# Altium schematic sheet Display.SchDoc
size 420 x 297 mm; SheetNumber: 4; SheetTotal: 4
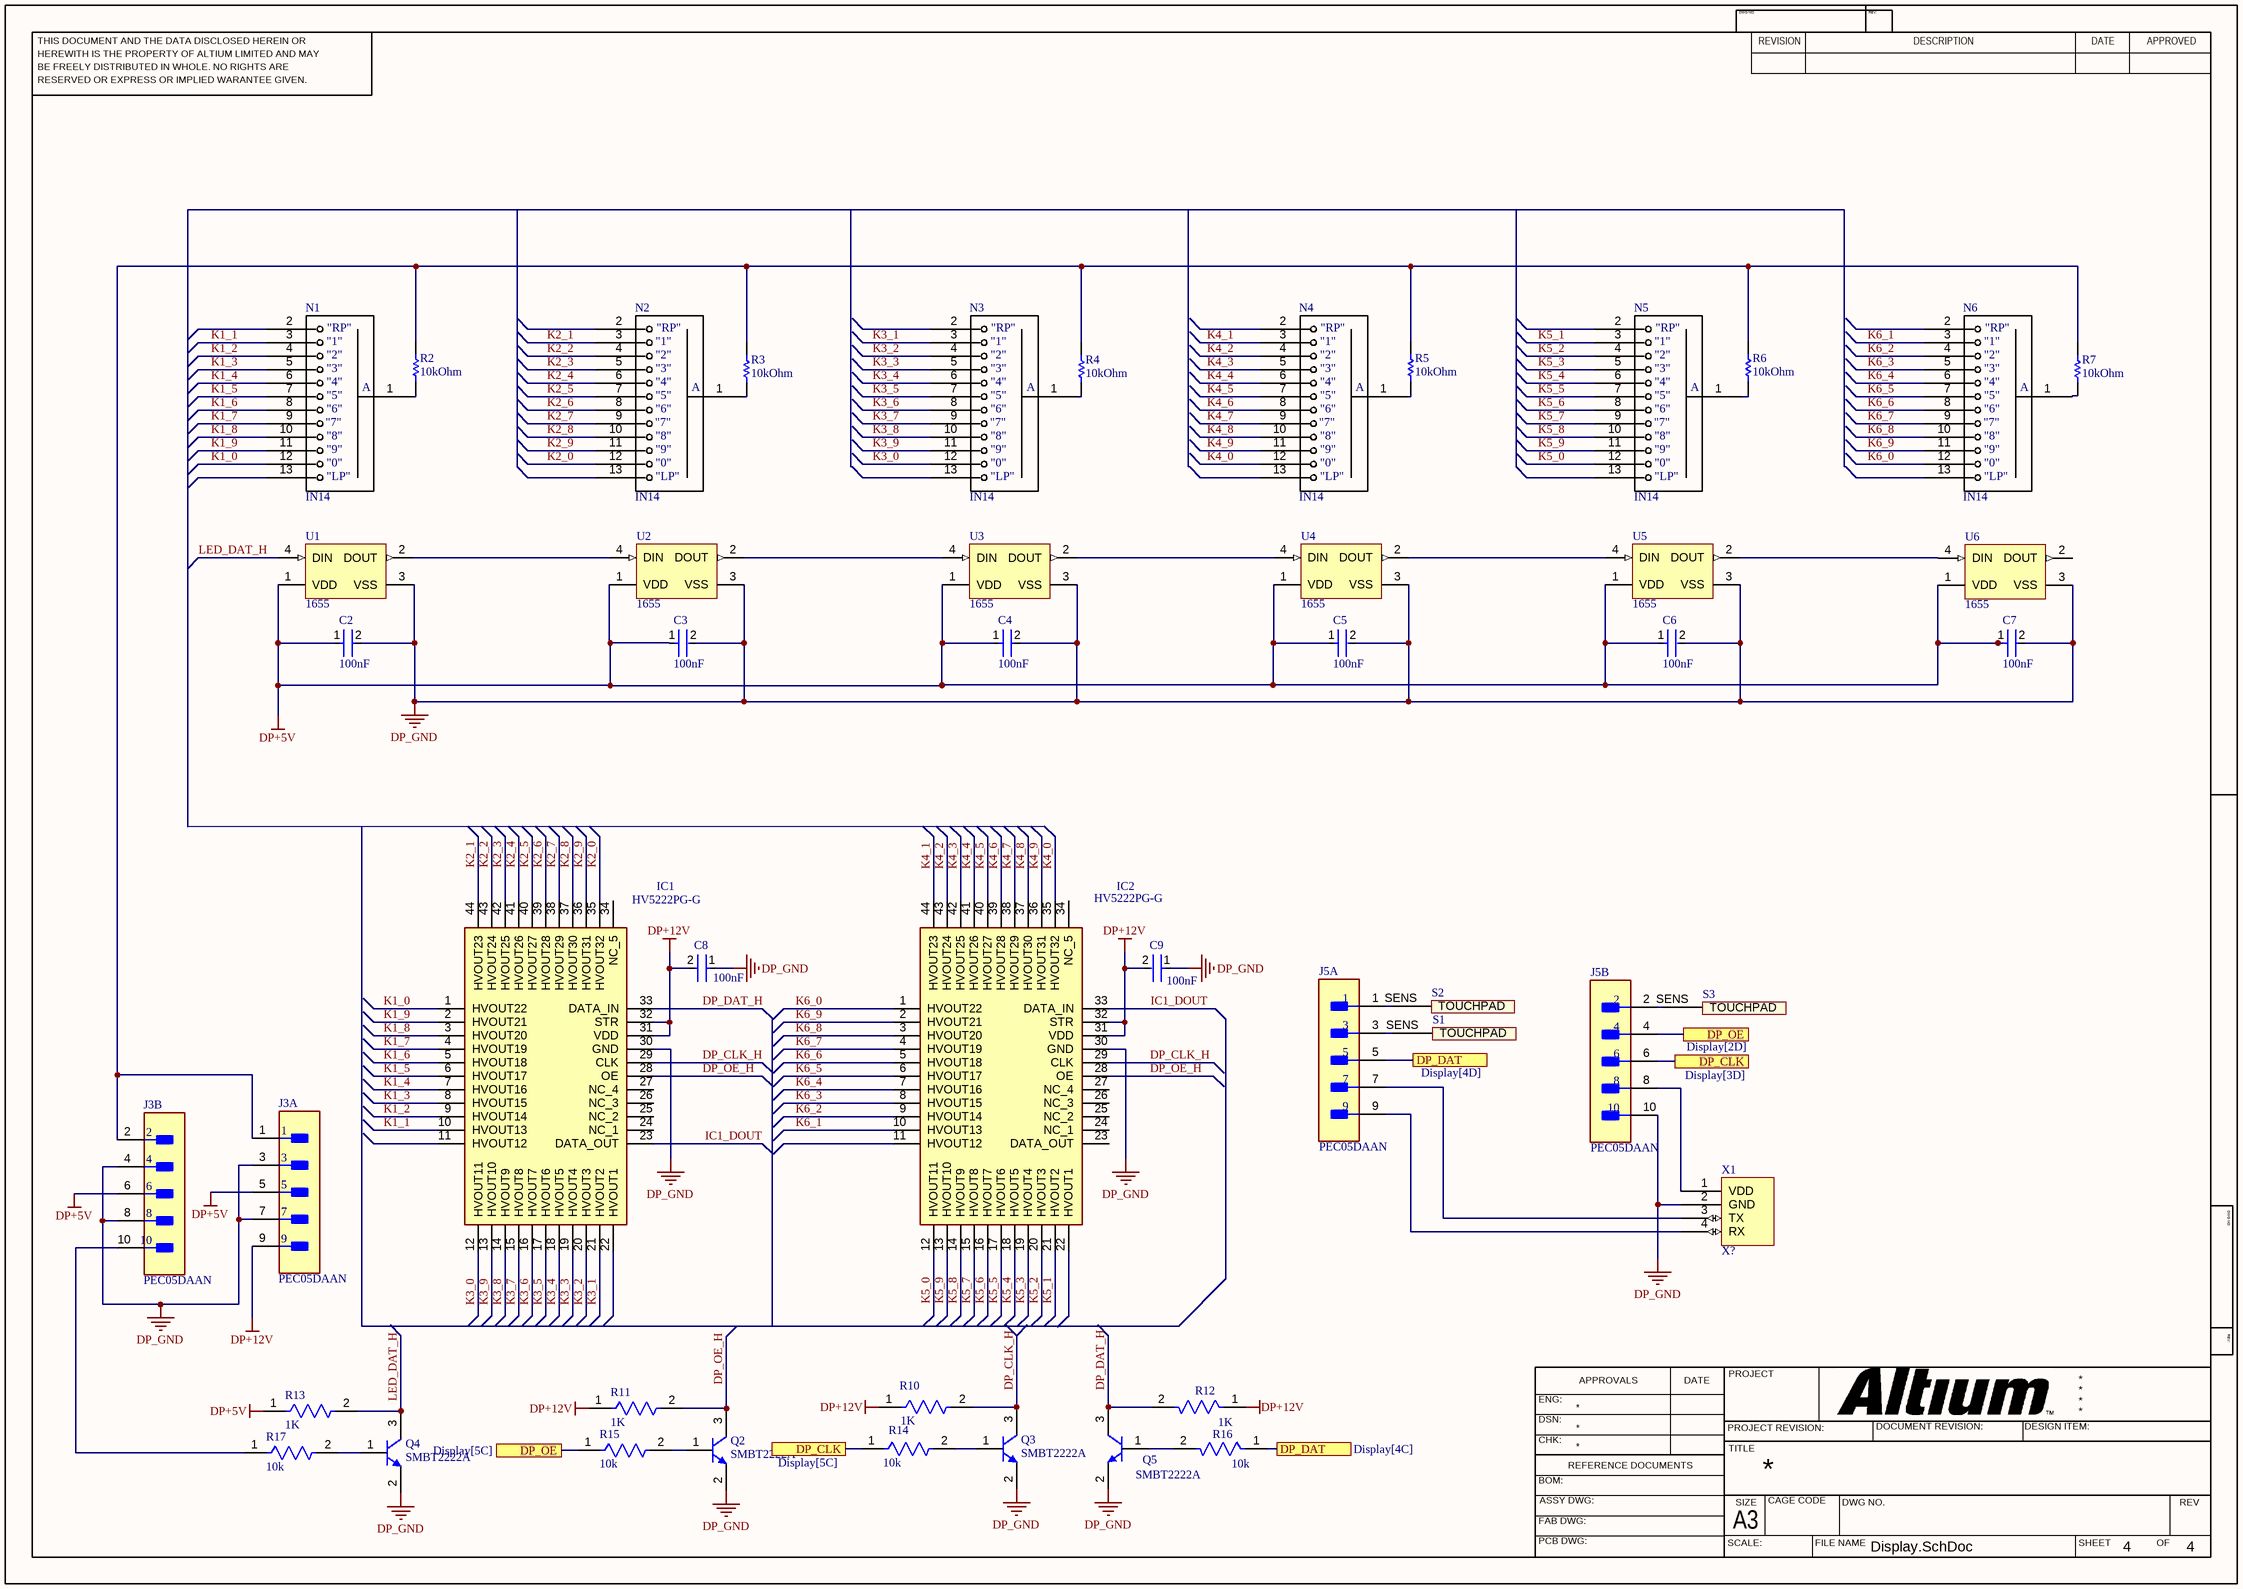
[diagram p0: Display.SchDoc]

## Parts
C2  100nF  [FP-CC0805-0_85-MFG]
C3  100nF  [FP-CC0805-0_85-MFG]
C4  100nF  [FP-CC0805-0_85-MFG]
C5  100nF  [FP-CC0805-0_85-MFG]
C6  100nF  [FP-CC0805-0_85-MFG]
C7  100nF  [FP-CC0805-0_85-MFG]
C8  100nF  [FP-CC0805-0_85-MFG]
C9  100nF  [FP-CC0805-0_85-MFG]
IC1  HV5222PG-G  [QFP80P1390X1390X235-44N]
IC2  HV5222PG-G  [QFP80P1390X1390X235-44N]
J3  PEC05DAAN  [FP-PEC05DAAN-MFG]  (parts A,B of 2)
J5  PEC05DAAN  [FP-PEC05DAAN-MFG]  (parts A,B of 2)
N1  IN14  [IN14]
N2  IN14  [IN14]
N3  IN14  [IN14]
N4  IN14  [IN14]
N5  IN14  [IN14]
N6  IN14  [IN14]
Q2  SMBT2222A  [INF-SOT23_L]
Q3  SMBT2222A  [INF-SOT23_L]
Q4  SMBT2222A  [INF-SOT23_L]
Q5  SMBT2222A  [INF-SOT23_L]
R2  10kOhm  [RESC3116X65X40ML10T20]
R3  10kOhm  [RESC3116X65X40ML10T20]
R4  10kOhm  [RESC3116X65X40ML10T20]
R5  10kOhm  [RESC3116X65X40ML10T20]
R6  10kOhm  [RESC3116X65X40ML10T20]
R7  10kOhm  [RESC3116X65X40ML10T20]
R10  1K  [FP-RC0805-0_6-IPC_C]
R11  1K  [FP-RC0805-0_6-IPC_C]
R12  1K  [FP-RC0805-0_6-IPC_C]
R13  1K  [FP-RC0805-0_6-IPC_C]
R14  10k  [FP-RC0805-0_6-IPC_C]
R15  10k  [FP-RC0805-0_6-IPC_C]
R16  10k  [FP-RC0805-0_6-IPC_C]
R17  10k  [FP-RC0805-0_6-IPC_C]
S1  (no value)  [SENS]
S2  TOUCHPAD  [SENS]  (value not drawn)
S3  TOUCHPAD  [SENS]  (value not drawn)
U1  1655  [ADA-RGB-1655_V]
U2  1655  [ADA-RGB-1655_V]
U3  1655  [ADA-RGB-1655_V]
U4  1655  [ADA-RGB-1655_V]
U5  1655  [ADA-RGB-1655_V]
U6  1655  [ADA-RGB-1655_V]
X1  X?  [4X1HEADER]

## Ports
DP_CLK (see Display[3D]), DP_CLK (see Display[5C]), DP_DAT (see Display[4C]), DP_DAT (see Display[4D]), DP_OE (see Display[2D]), DP_OE (see Display[5C])

## Nets
DP+5V: C2.1 C3.1 C4.1 C5.1 C6.1 C7.1 J3.5 J3.6 R13.1 U1.1(VDD) U2.1(VDD) U3.1(VDD) U4.1(VDD) U5.1(VDD) U6.1(VDD)
DP+12V: C8.2 C9.2 IC1.31(VDD) IC1.32(STR) IC2.31(VDD) IC2.32(STR) J3.9 R10.1 R11.1 R12.1
DP_GND: C2.2 C3.2 C4.2 C5.2 C6.2 C7.2 C8.1 C9.1 IC1.30(GND) IC2.30(GND) J3.3 J3.4 J3.7 J3.8 J5.10 Q2.2(E) Q3.2(E) Q4.2(E) Q5.2(E) U1.3(VSS) U2.3(VSS) U3.3(VSS) U4.3(VSS) U5.3(VSS) U6.3(VSS) X1.2(GND)
DP_CLK: J5.6 R14.1 ; port DP_CLK
DP_CLK_H: IC1.29(CLK) IC2.29(CLK) Q3.3(C) R10.2
DP_DAT: J5.5 R16.1 ; port DP_DAT
DP_DAT_H: IC1.33(DATA_IN) Q5.3(C) R12.2
DP_OE: J5.4 R15.1 ; port DP_OE
DP_OE_H: IC1.28(OE) IC2.28(OE) Q2.3(C) R11.2
IC1_DOUT: IC1.23(DATA_OUT) IC2.33(DATA_IN)
K1_0: IC1.1(HVOUT22) N1.12
K1_1: IC1.10(HVOUT13) N1.3
K1_2: IC1.9(HVOUT14) N1.4
K1_3: IC1.8(HVOUT15) N1.5
K1_4: IC1.7(HVOUT16) N1.6
K1_5: IC1.6(HVOUT17) N1.7
K1_6: IC1.5(HVOUT18) N1.8
K1_7: IC1.4(HVOUT19) N1.9
K1_8: IC1.3(HVOUT20) N1.10
K1_9: IC1.2(HVOUT21) N1.11
K2_0: IC1.35(HVOUT32) N2.12
K2_1: IC1.44(HVOUT23) N2.3
K2_2: IC1.43(HVOUT24) N2.4
K2_3: IC1.42(HVOUT25) N2.5
K2_4: IC1.41(HVOUT26) N2.6
K2_5: IC1.40(HVOUT27) N2.7
K2_6: IC1.39(HVOUT28) N2.8
K2_7: IC1.38(HVOUT29) N2.9
K2_8: IC1.37(HVOUT30) N2.10
K2_9: IC1.36(HVOUT31) N2.11
K3_0: IC1.12(HVOUT11) N3.12
K3_1: IC1.21(HVOUT2) N3.3
K3_2: IC1.20(HVOUT3) N3.4
K3_3: IC1.19(HVOUT4) N3.5
K3_4: IC1.18(HVOUT5) N3.6
K3_5: IC1.17(HVOUT6) N3.7
K3_6: IC1.16(HVOUT7) N3.8
K3_7: IC1.15(HVOUT8) N3.9
K3_8: IC1.14(HVOUT9) N3.10
K3_9: IC1.13(HVOUT10) N3.11
K4_0: IC2.35(HVOUT32) N4.12
K4_1: IC2.44(HVOUT23) N4.3
K4_2: IC2.43(HVOUT24) N4.4
K4_3: IC2.42(HVOUT25) N4.5
K4_4: IC2.41(HVOUT26) N4.6
K4_5: IC2.40(HVOUT27) N4.7
K4_6: IC2.39(HVOUT28) N4.8
K4_7: IC2.38(HVOUT29) N4.9
K4_8: IC2.37(HVOUT30) N4.10
K4_9: IC2.36(HVOUT31) N4.11
K5_0: IC2.12(HVOUT11) N5.12
K5_1: IC2.21(HVOUT2) N5.3
K5_2: IC2.20(HVOUT3) N5.4
K5_3: IC2.19(HVOUT4) N5.5
K5_4: IC2.18(HVOUT5) N5.6
K5_5: IC2.17(HVOUT6) N5.7
K5_6: IC2.16(HVOUT7) N5.8
K5_7: IC2.15(HVOUT8) N5.9
K5_8: IC2.14(HVOUT9) N5.10
K5_9: IC2.13(HVOUT10) N5.11
K6_0: IC2.1(HVOUT22) N6.12
K6_1: IC2.10(HVOUT13) N6.3
K6_2: IC2.9(HVOUT14) N6.4
K6_3: IC2.8(HVOUT15) N6.5
K6_4: IC2.7(HVOUT16) N6.6
K6_5: IC2.6(HVOUT17) N6.7
K6_6: IC2.5(HVOUT18) N6.8
K6_7: IC2.4(HVOUT19) N6.9
K6_8: IC2.3(HVOUT20) N6.10
K6_9: IC2.2(HVOUT21) N6.11
LED_DAT_H: Q4.3(C) R13.2 U1.4(DIN)
NetJ3_1: J3.1 J3.2 R2.2 R3.2 R4.2 R5.2 R6.2 R7.2
NetJ3_10: J3.10 R17.1
NetJ5_1: J5.1 S2.SENS(TOUCHPAD)
NetJ5_2: J5.2 S3.SENS(TOUCHPAD)
NetJ5_3: J5.3 S1.SENS(TOUCHPAD)
NetJ5_7: J5.7 X1.3(TX)
NetJ5_8: J5.8 X1.1(VDD)
NetJ5_9: J5.9 X1.4(RX)
NetN1_1: N1.1 R2.1
NetN2_1: N2.1 R3.1
NetN3_1: N3.1 R4.1
NetN4_1: N4.1 R5.1
NetN5_1: N5.1 R6.1
NetN6_1: N6.1 R7.1
NetQ2_1: Q2.1(B) R15.2
NetQ3_1: Q3.1(B) R14.2
NetQ4_1: Q4.1(B) R17.2
NetQ5_1: Q5.1(B) R16.2
NetU1_2: U1.2(DOUT) U2.4(DIN)
NetU2_2: U2.2(DOUT) U3.4(DIN)
NetU3_2: U3.2(DOUT) U4.4(DIN)
NetU4_2: U4.2(DOUT) U5.4(DIN)
NetU5_2: U5.2(DOUT) U6.4(DIN)

Not connected (* = marked no-connect by the designer): IC1 11(HVOUT12) 22(HVOUT1) 24(NC_1) 25(NC_2) 26(NC_3) 27(NC_4) 34(NC_5); IC2 11(HVOUT12) 22(HVOUT1) 23(DATA_OUT) 24(NC_1) 25(NC_2) 26(NC_3) 27(NC_4) 34(NC_5); N1 2 13; N2 2 13; N3 2 13; N4 2 13; N5 2 13; N6 2 13; U6 2(DOUT)

## Notes on the sheet
- THIS DOCUMENT AND THE DATA DISCLOSED HEREIN OR
- HEREWITH IS THE PROPERTY OF ALTIUM LIMITED AND MAY
- DWG NO:
- REVISION
- REV:
- DESCRIPTION
- DATE
- APPROVED
- BE FREELY DISTRIBUTED IN WHOLE. NO RIGHTS ARE
- RESERVED OR EXPRESS OR IMPLIED WARANTEE GIVEN.
- ENG:
- APPROVALS
- PROJECT
- DSN:
- CHK:
- REFERENCE DOCUMENTS
- PROJECT REVISION:
- TITLE
- DOCUMENT REVISION:
- DESIGN ITEM:
- BOM:
- FAB DWG:
- PCB DWG:
- ASSY DWG:
- SCALE:
- A3
- SIZE
- CAGE CODE
- FILE NAME
- DWG NO.
- SHEET
- OF
- REV
- (in symbol IN14) "RP"; "1"; "2"; "3"; "4"; A; "5"; "6"; "7"; "8"; "9"; "0"; "LP"

## Library data of the parts
C2-C9 = CMP-2100-03606-3: CAP CER 0.1UF 50V X7R 0805; Manufacturer Part Number: CC0805KRX7R9BB104; Manufacturer: Yageo; Tolerance: 0.1; Material: Ceramic; Device Class L1: Passive Components; ComponentLink2Description: Datasheet; Package: CC0805-0.85; Digikey Description: CAP CER 0.1UF 50V X7R 0805; Capacitance: 100 nF; Device Class L3: Ceramic Capacitors; Value: 100 nF; Temperature: -30°C to +85°C; Temperature Characteristic: X7R; Voltage Rating: 50 V; Height: 0.95mm; RoHS: TRUE; Ipc Land Pattern Name: CAPC200125X85; Device Class L2: Capacitors; Category: Cap; Temperature Range Low: -30°C; Temperature Range High: +85°C; Mouser Description: Multilayer Ceramic Capacitors MLCC - SMD/SMT 100nF 50V X7R 10%; Footprint Url: http://www.yageo.com/exep/pages/download/literatures/UPY-C_GEN_24.pdf; Automotive: No; Octopart: https://octopart.com/cc0805krx7r9bb104-yageo-192993; Lead Free: Yes; ComponentLink2URL: http://www.yageo.com/documents/recent/UPY-GPHC_Y5V_6.3V-to-50V_8.pdf
IC1 IC2 = HV5222PG-G: Integrated Circuit; Manufacturer_Name: Microchip; Datasheet Link: http://www.microchip.com/mymicrochip/filehandler.aspx?ddocname=en570722; Height: 2.35mm; Manufacturer_Part_Number: HV5222PG-G; Mouser Part Number: 689-HV5222PG-G; Mouser Price/Stock: https://www.mouser.co.uk/ProductDetail/Microchip-Technology/HV5222PG-G?qs=jjdktuRV%2Fgh6FkXzyQ9ehg%3D%3D; Arrow Part Number: HV5222PG-G; Arrow Price/Stock: https://www.arrow.com/en/products/hv5222pg-g/microchip-technology
J3 J5 = CMP-25680-000034-1: CONN HEADER VERT 10POS 2.54MM; Pitch: 0.1inch; Number of Positions: 10; Gender: Male; Connector Type: Male Pin; Contact Type: Male Pin; Height: 2.54mm; Termination: Solder; Packaging: Bulk; Housing Material: Plastic; Contact Mating Length: 0.23inch; Width: 5.08mm; Row Spacing: 0.1inch; Housing Color: Black; Mount: Through Hole; Contact Plating: Tin; Contact Material: Bronze; Color: Black; Package Quantity: 1; Length: 12.7mm; Lead Free: Lead Free; Number of Rows: 2; Number of Contacts: 10
Q2-Q5 = CMP-1178-00004-1: NPN Silicon Switching Transistor, 40 V VCEO, 600 mA IC, SOT23, Reel, Green; Manufacturer: Infineon; IC (max): 600 mA; IC: 150 mA; VCE: 10 V; VCEO (max): 40 V; VCBO (max): 75 V; VEBO (max): 6 V; ICBO (max): 10 nA; Green: TRUE; Mounting Technology: Surface Mount; PackageDescription: 3-Pin Small Outline Transistor Package, 1.3 x 2.9 mm Body, 0.95 mm Pitch; ComponentLink1Description: Manufacturer URL; ComponentLink3URL: http://www.infineon.com/dgdl/SOT23-Package_Overview.pdf?folderId=db3a30431936bc4b0119532290053c66&fileId=db3a30431936bc4b0119533468123c85; PackageVersion: Apr-08; VCE (max): 10 V; ComponentLink1URL: http://www.infineon.com/; Packing: Reel; ComponentLink2URL: http://www.infineon.com/dgdl/smbt2222a_mmbt2222a.pdf?folderId=db3a30431441fb5d011445fab851018e&fileId=db3a30431441fb5d011445fbaff0018f; PartNumber: SMBT2222A; PackageReference: SOT23; ComponentLink3Description: Package Specification; Polarity: NPN; ComponentLink2Description: Datasheet
R2-R7 = CMP-2100-03674-1: Chip Resistor, 100 KOhm, +/- 1%, 0.25 W, -55 to 155 degC, 1206 (3216 Metric), RoHS, Tape and Reel; Manufacturer: Yageo; Voltage Rating: 200V; Temperature Coefficient: 100ppm/degreesC; Power Rating: 250mW; Case Code (Metric): 3216; Composition: ThickFilm; Lead Free: LeadFree; Max Operating Temperature: 155degC; Case/Package: 1206; Min Operating Temperature: -55degC; Depth: 1.6mm; RoHSCompliant: true; Datasheet URL: http://www.yageo.com/NewPortal/yageodocoutput?fileName=/pdf/R-Chip/PYu-RC_Group_51_RoHS_L_5.pdf; Datasheet Version: Rev. 5, 10/2016; Package Reference: 1206.0; Packaging: TapeandReel; Resistance: 100KOhm; Manufacturer URL: http://www.yageo.com/; Tolerance: 1%; Height: 0.55mm; REACH SVHC: NoSVHC; Case Code (Imperial): 1206; Length: 3.1mm; Package Description: 2-Pin Surface Mount Device, Body 3.1 x 1.6 mm; Termination: SMD/SMT
R10-R17 = CMP-2100-03668-5: RES 100K OHM 1% 1/8W 0805; Power Rating: 125mW; Temperature Coefficient: 100ppm/°C; Voltage Rating (DC): 150V; Resistance: 100kR; Package Quantity: 1; Case/Package: 0805; Lead Pitch: 0.4mm; Case Code (Imperial): 0805; Construction: Rectangular; Number of Terminations: 2; RoHS Compliant: Yes; Max Power Dissipation: 125mW; Tolerance: 1%; Max Operating Temperature: 155°C; Resistance Tolerance: 1%; Lead Free: Lead Free; Packaging: Tape and Reel; Resistor Type: Thick Film; Min Operating Temperature: -55°C; Case Code (Metric): 2012; Series: RC; Technology: THICK FILM; Voltage Rating: 150V; Termination: SMD/SMT; Width: 0.049inch; Number of Pins: 2; Features: Moisture Resistant; Military Standard: Not; Length: 0.079inch; Depth: 1.25mm; Size Code: 0805; Height: 0.024inch
S1-S3 = SENS
U1-U6 = CMP-2000-05026-1: Intelligent Control LED Integrated Light Source, 3.5 to 5.3 V, -25 to 80 degC, 4-Pin SMD, RoHS, Tape and Reel; Manufacturer: Adafruit-Industries-LLC; Number of LEDs: 10; Configuration: Discrete; Utilized LED: WS2812(5050); Datasheet URL: http://datasheet.octopart.com/ADA1655-Adafruit-Industries-datasheet-32028139.pdf; Series: Neopixel; Interface: -; Package Description: 4-Pin Surface Mount Device, Body 5 x 5 mm; Color: Red,Green,Blue(RGB); Category: Optoelectronics; Controller Type: -; Package Reference: 1655; Manufacturer URL: https://www.adafruit.com/; Mounting Type: SurfaceMount; Datasheet Version: May-13; Size / Dimension: 5.00mmLx5.00mmW; Family: Addressable,Specialty
X1 = UART_HEEADER